# Altium schematic sheet NEW.SchDoc
size 420 x 297 mm; SheetNumber: 8; SheetTotal: 8
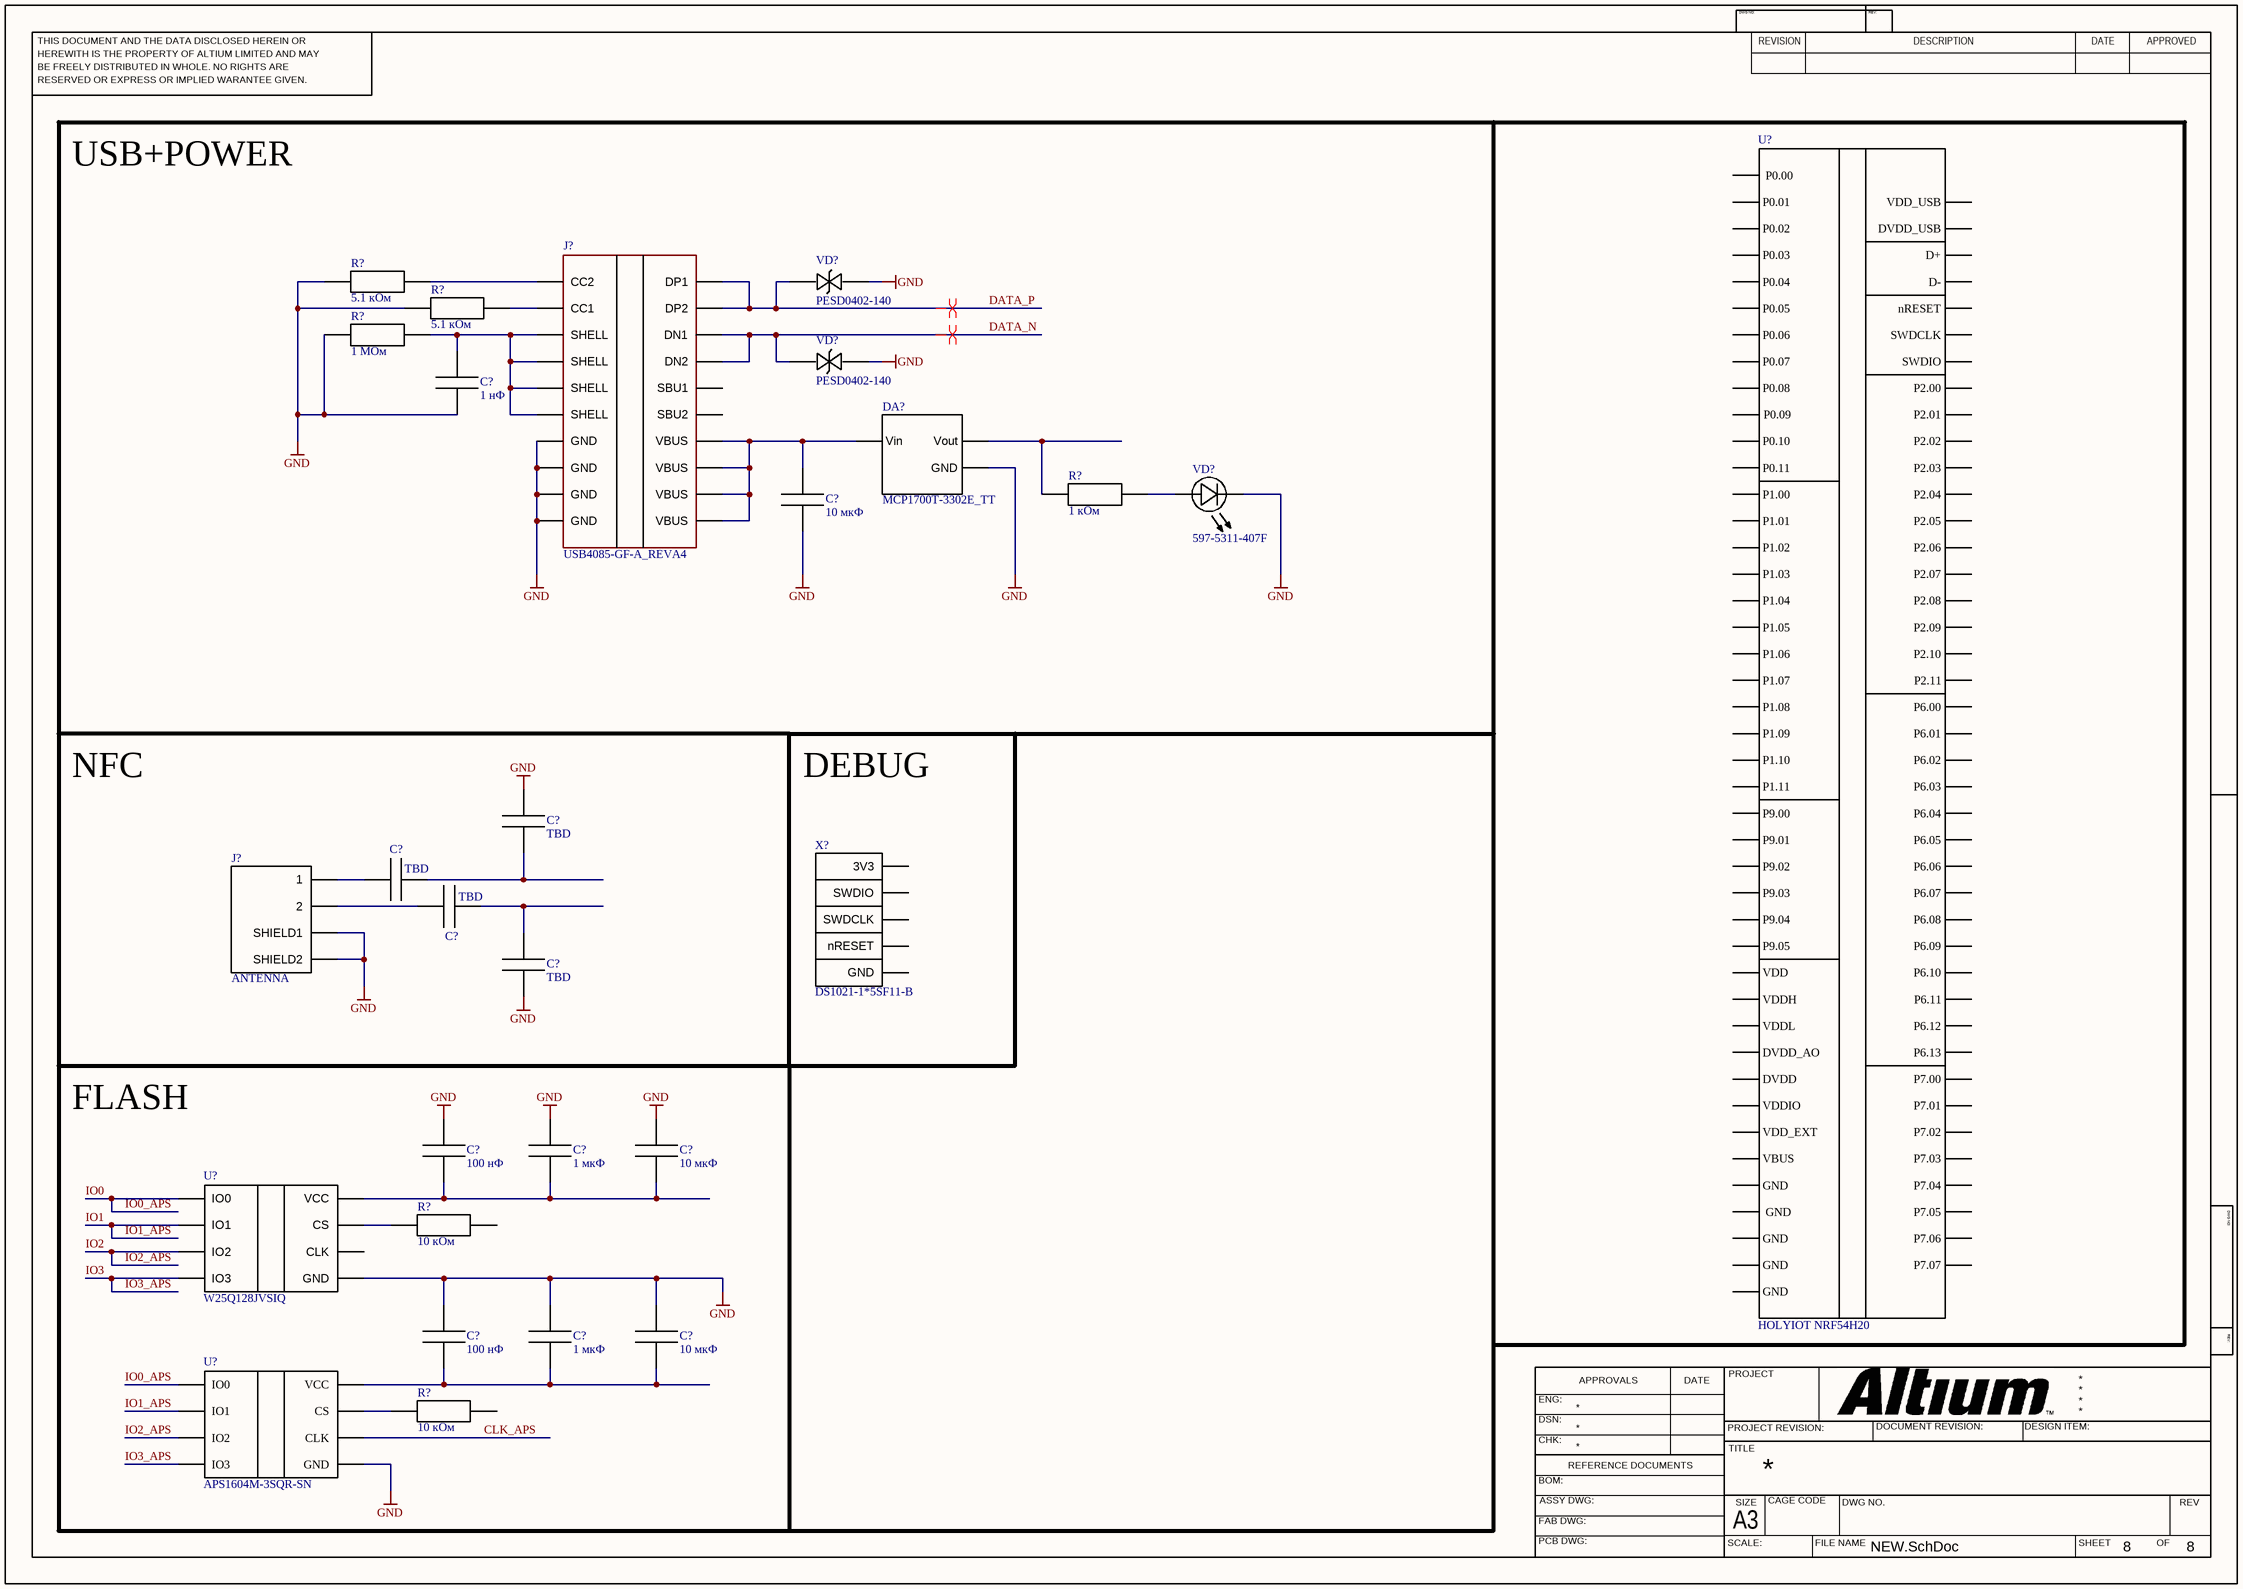
[diagram p0: NEW.SchDoc]

## Parts
(Parts that share a designator on the sheet are numbered #1, #2 ... from top to bottom, then left to right.)
C?#1  1 нФ  [CAPC1608X90N]
C?#2  10 мкФ  [CAPC1608X100N]
C?#3  TBD  [CAPC1608X90N]
C?#4  TBD  [CAPC1608X90N]
C?#5  TBD  [CAPC1608X90N]
C?#6  TBD  [CAPC1608X90N]
C?#7  100 нФ  [CAPC1608X90N]
C?#8  1 мкФ  [CAPC1608X90N]
C?#9  10 мкФ  [CAPC1608X100N]
C?#10  100 нФ  [CAPC1608X90N]
C?#11  1 мкФ  [CAPC1608X90N]
C?#12  10 мкФ  [CAPC1608X100N]
DA?  MCP1700T-3302E_TT  [SOT95P237X112-3N]
J?#1  USB4085-GF-A_REVA4  [GCT_USB4085-GF-A_REVA4]
J?#2  ANTENNA  [MOLEX_532610271]
R?#1  5.1 кОм  [RESC1607X60N]
R?#2  5.1 кОм  [RESC1607X60N]
R?#3  1 МОм  [RESC1607X60N]
R?#4  1 кОм  [RESC1607X60N]
R?#5  10 кОм  [RESC1607X60N]
R?#6  10 кОм  [RESC1607X60N]
U?#1  W25Q128JVSIQ  [SOIC127P790X216-8N]
U?#2  HOLYIOT NRF54H20  [HOLYIOT NRF54H20]
U?#3  APS1604M-3SQR-SN  [APS1604M (SOP-8)]
VD?#1  PESD0402-140  [DIO_PESD0402-140]
VD?#2  PESD0402-140  [DIO_PESD0402-140]
VD?#3  597-5311-407F  [LEDC2012X70N]
X?  DS1021-1*5SF11-B  [Дебаг]

## Nets
GND: C?#1.1 C?#2.1 C?#3.1 C?#6.2 C?#7.2 C?#8.2 C?#9.2 C?#10.2 C?#11.2 C?#12.2 DA?.1(GND) J?#1.A1(GND) J?#1.A12(GND) J?#1.B1(GND) J?#1.B12(GND) J?#2.S1(SHIELD1) J?#2.S2(SHIELD2) R?#1.1 R?#2.1 R?#3.1 U?#1.4(GND) U?#3.4(GND) VD?#1.1 VD?#2.1 VD?#3.C
CLK_APS: U?#3.6(CLK)
DATA_N: J?#1.A7(DN1) J?#1.B7(DN2) VD?#2.2
DATA_P: J?#1.A6(DP1) J?#1.B6(DP2) VD?#1.2
IO0: U?#1.5(IO0) U?#3.5(IO0)  [also labelled IO0_APS]
IO1: U?#1.2(IO1) U?#3.2(IO1)  [also labelled IO1_APS]
IO2: U?#1.3(IO2) U?#3.3(IO2)  [also labelled IO2_APS]
IO3: U?#1.7(IO3) U?#3.7(IO3)  [also labelled IO3_APS]
NetC?#1_2: C?#1.2 J?#1.S1(SHELL) J?#1.S2(SHELL) J?#1.S3(SHELL) J?#1.S4(SHELL) R?#3.2
NetC?#2_2: C?#2.2 DA?.3(Vin) J?#1.A4(VBUS) J?#1.A9(VBUS) J?#1.B4(VBUS) J?#1.B9(VBUS)
NetC?#3_2: C?#3.2 C?#4.2
NetC?#4_1: C?#4.1 J?#2.1
NetC?#5_1: C?#5.1 J?#2.2
NetC?#5_2: C?#5.2 C?#6.1
NetC?#7_1: C?#7.1 C?#8.1 C?#9.1 U?#1.8(VCC)
NetC?#10_1: C?#10.1 C?#11.1 C?#12.1 U?#3.8(VCC)
NetDA?_2: DA?.2(Vout) R?#4.2
NetJ?#1_A5: J?#1.A5(CC1) R?#2.2
NetJ?#1_B5: J?#1.B5(CC2) R?#1.2
NetR?#4_1: R?#4.1 VD?#3.A
NetR?#5_1: R?#5.1 U?#1.1(CS)
NetR?#6_1: R?#6.1 U?#3.1(CS)

Not connected (* = marked no-connect by the designer): J?#1 A8(SBU1) B8(SBU2); R?#5 2; R?#6 2; U?#1 6(CLK); U?#2 1(GND) 2(VDDH) 3(VDD) 4(_GND) 5(DVDD) 6(DVDD_AO) 7(P6.13) 8(P6.12) 9(P6.11) 10(P6.10) 11(P6.09) 12(P6.08) 13(P6.07) 14(P6.06) 15(P6.00) 16(P6.01) 17(P6.02) 18(P6.03) 19(P6.04) 20(P6.05) 21(P2.00) 22(P2.01) 23(P2.02) 24(P2.03) 25(P2.04) 26(P2.11) 27(P2.10) 28(GND) 29(GND) 30(P2.09) 31(P2.08) 32(P2.07) 33(P2.06) 34(P2.05) 35(P7.07) 36(P7.06) 37(P7.05) 38(P7.04) 39(P7.03) 40(P7.02) 41(P7.01) 42(P7.00) 43(_P0.09) 44(P0.08) 45(P0.05) 46(P0.06) 47(P0.07) 48(P9.00) 49(P9.01) 50(_P0.00) 51(P0.04) 52(P1.04) 53(P1.03) 54(P1.02) 55(VDDL) 56(P1.01) 57(P1.00) 58(GND) 59(P1.06) 60(P1.07) 61(P1.09) 62(P9.05) 63(P9.04) 64(P9.03) 65(P9.02) 66(P0.03) 67(P0.02) 68(P0.01) 69(P0.10) 70(P0.11) 71(VDDIO) 72(nRESET) 73(SWDIO) 74(SWDCLK) 75(VDD_EXT) 76(DVDD_USB) 77(VBUS) 78(D-) 79(D+) 80(VDD_USB) 81(P1.10) 82(P1.11) 83(P1.08) 84(P1.05); X? 1(3V3) 2(SWDIO) 3(SWDCLK) 4(nRESET) 5(GND)

## Layout directives
differential pair; differential pair class USB: DATA_N, DATA_P

## Notes on the sheet
- USB+POWER
- NFC
- DEBUG
- FLASH
- THIS DOCUMENT AND THE DATA DISCLOSED HEREIN OR
- HEREWITH IS THE PROPERTY OF ALTIUM LIMITED AND MAY
- DWG NO:
- REVISION
- REV:
- DESCRIPTION
- DATE
- APPROVED
- BE FREELY DISTRIBUTED IN WHOLE. NO RIGHTS ARE
- RESERVED OR EXPRESS OR IMPLIED WARANTEE GIVEN.
- ENG:
- APPROVALS
- PROJECT
- DSN:
- CHK:
- REFERENCE DOCUMENTS
- PROJECT REVISION:
- TITLE
- DOCUMENT REVISION:
- DESIGN ITEM:
- BOM:
- FAB DWG:
- PCB DWG:
- ASSY DWG:
- SCALE:
- A3
- SIZE
- CAGE CODE
- FILE NAME
- DWG NO.
- SHEET
- OF
- REV

## Library data of the parts
C?#1 = GRM188R72A102KA01D: SMD Capacitor X7R(EIA) with Capacitance: 1000pF Tol. 10%. Rated Voltage: 100Vdc; Типоразмер: 0603; Т коэф. емкости: Х7R; Точность: 10%; Рабочее напряжение: 100 В; Емкость: 1 нФ; Ссылка: https://www.chipdip.ru/product/1000pf-x7r-100v-10-0603-grm188r72a102ka01d-murata-9000121448
C?#2 C?#9 C?#12 = GRM188R61E106KA73D: SMD capacitor X5R(EIA) with capacitance 10uF Tol.10%. Rated voltage 25Vdc 85C; Типоразмер: 0603; Точность: 10%; Напряжение: 25 В; Емкость: 10 мкФ; Т коэф. емкости: X5R
C?#3-C?#6 = GRM1885C1HR30CD01D: 0.3 pF Â±0.25pF 50V Ceramic Capacitor C0G, NP0 0603 (1608 Metric); Типоразмер: 0603; Емкость: Отладка; Т коэф. емкости: C0G(NP0); Напряжение: 50 В; Точность: 0.5%
C?#7 C?#10 = CL10B104KO8NNNC: CL10 Series 0.1 uF 16 V Â±10% Tolerance X7R SMT Multilayer Ceramic Capacitor; Типоразмер: 0603; Точность: 10%; Напряжение: 16; Емкость: 100 нФ; Т коэф. емкости: X7R
C?#8 C?#11 = GRM188R61E105KA12D: SMD KondansatÃ¶r X5R(EIA) Kapasite: 1.0uF Tol. %10. Anma VoltajÄ±: 25Vdc; Типоразмер: 0603; Точность: 10%; Напряжение: 25 В; Емкость: 1 мкФ; Т коэф. емкости: X5R
DA? = MCP1700T-3302E_TT: Pwr Sply Func,Voltage Regulator,LDO,SOT-23,PD 369.6mW,VO 3.3V,Regline +/-0.75%/V | Microchip Technology Inc. MCP1700T-3302E/TT; SnapEDA_Link: https://www.snapeda.com/parts/MCP1700T-3302E/TT/Microchip/view-part/?ref=snap; Package: SOT-23 Microchip; Value: *; MF: Microchip; MP: MCP1700T-3302E/TT; Check_prices: https://www.snapeda.com/parts/MCP1700T-3302E/TT/Microchip/view-part/?ref=eda
J?#1 = USB4085-GF-A_REVA4: USB-C (USB TYPE-C) USB 2.0 Receptacle Connector 24 (16+8 Dummy) Position Through Hole, Right Angle, low cost, 3.46mm profile, 16 pin, horizontal, Top mount; MF: Global Connector Technology; SnapEDA_Link: https://www.snapeda.com/parts/USB4085-GF-A/Global+Connector+Technology/view-part/?ref=snap; Package: None; MP: USB4085-GF-A; Check_prices: https://www.snapeda.com/parts/USB4085-GF-A/Global+Connector+Technology/view-part/?ref=eda; Purchase-URL: https://pricing.snapeda.com/search/part/USB4085-GF-A/?ref=eda; Price: None; Value: *; Availability: In Stock
J?#2 = 532610271: Connector Header Surface Mount, Right Angle 2 position 0.049 (1.25mm); MF: Molex; Purchase-URL: https://pricing.snapeda.com/search/part/532610271/?ref=eda; Value: *; MP: 532610271; Package: None; Check_prices: https://www.snapeda.com/parts/532610271/Molex/view-part/?ref=eda; Price: None; Availability: In Stock; SnapEDA_Link: https://www.snapeda.com/parts/532610271/Molex/view-part/?ref=snap
R?#1 R?#2 = RC0603FR-075K1L: 5.1 kOhms Â±1% 0.1W, 1/10W Chip Resistor 0603 (1608 Metric) Moisture Resistant Thick Film; Типоразмер: 0603; Мощность: 0.1 Вт; Точность: 1%; Рабочее напряжение: 200 В; Сопротивление: 5.1 кОм
  R?#1: ComponentLink1Description: New link; ComponentLink1URL: *
R?#3 = RC0603FR-071ML: 1 MOhms Â±1% 0.1W, 1/10W Chip Resistor 0603 (1608 Metric) Moisture Resistant Thick Film; Типоразмер: 0603; Мощность: 0.1 Вт; Точность: 1%; Рабочее напряжение: 200 В; Сопротивление: 1 МОм; Ссылка: https://www.chipdip.ru/product/0.1vt-0603-1-mom-rc0603fr-071ml-chip-rezistor-smd-yageo-9000348749
R?#4 = RC0603FR-071KL: 1 kOhms Â±1% 0.1W, 1/10W Chip Resistor 0603 (1608 Metric) Moisture Resistant Thick Film; Типоразмер: 0603; Мощность: 0.1 В; Точность: 1 %; Рабочее напряжение: 200 В; Сопротивление: 1 кОм
R?#5 R?#6 = RC0603FR-0710KL: 10 kOhms Â±1% 0.1W, 1/10W Chip Resistor 0603 (1608 Metric) Moisture Resistant Thick Film; Типоразмер: 0603; Мощность: 0.1 Вт; Точность: 1%; Напряжение: 75 В; Сопротивление: 10 кОм
U?#1 = W25Q128JVSIQ: FLASH - NOR Memory IC 128Mb (16M x 8) SPI - Quad I/O, QPI, DTR 133 MHz 8-SOIC; Корпус: SOIC-8; IO0: (DATA INPUT); IO1: (DATA OUTPUT); IO2: (WRITE PROTECT); IO3: (HOLD/RESET)
U?#3 = APS1604M: Корпус: TSOP-8; Шаг: 1.27
VD?#1 VD?#2 = PESD0402-140: 40V Clamp - Ipp Tvs Diode Surface Mount 0402; Типоразмер: 0402; Емкость: 0.25 пФ; Тип: ESD защита
VD?#3 = 597-5311-407F: Indicators; Surface Mount; LED; SMD; Green; Right Angle; 25 mA | Dialight 597-5311-407F; Типоразмер: 0805; Цвет: Зеленый
X? = Дебаг: Тип: Вилка штыревая прямая; Количество штырей: 1*5; Шаг штырей: 2.54 мм